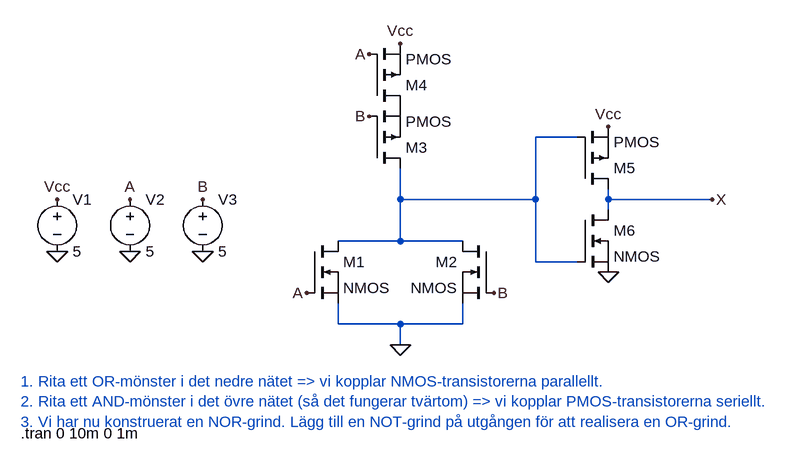
[diagram p0: schematic or.asc]
or.asc, the LTspice schematic file:
Version 4.1
SHEET 1 1244 680
WIRE 816 32 752 32
WIRE 544 128 544 80
WIRE 752 128 752 32
WIRE 752 128 544 128
WIRE 864 128 864 112
WIRE 1024 128 864 128
WIRE 864 144 864 128
WIRE 544 192 544 128
WIRE 544 192 448 192
WIRE 640 192 544 192
WIRE 752 224 752 128
WIRE 816 224 752 224
WIRE 448 320 448 288
WIRE 544 320 448 320
WIRE 640 320 640 288
WIRE 640 320 544 320
WIRE 544 352 544 320
FLAG 16 208 0
FLAG 128 208 0
FLAG 240 208 0
FLAG 16 128 Vcc
FLAG 128 128 A
FLAG 240 128 B
FLAG 544 352 0
FLAG 400 272 A
FLAG 688 272 B
FLAG 544 -112 Vcc
FLAG 496 -96 A
FLAG 496 0 B
FLAG 864 240 0
FLAG 864 16 Vcc
FLAG 1024 128 X
SYMBOL voltage 16 112 R0
WINDOW 123 0 0 Left 0
WINDOW 39 0 0 Left 0
SYMATTR InstName V1
SYMATTR Value 5
SYMBOL voltage 128 112 R0
WINDOW 123 0 0 Left 0
WINDOW 39 0 0 Left 0
SYMATTR InstName V2
SYMATTR Value 5
SYMBOL voltage 240 112 R0
WINDOW 123 0 0 Left 0
WINDOW 39 0 0 Left 0
SYMATTR InstName V3
SYMATTR Value 5
SYMBOL nmos 400 192 R0
SYMATTR InstName M1
SYMBOL nmos 688 192 M0
SYMATTR InstName M2
SYMBOL pmos 496 80 M180
SYMATTR InstName M3
SYMBOL pmos 496 -16 M180
SYMATTR InstName M4
SYMBOL pmos 816 112 M180
SYMATTR InstName M5
SYMBOL nmos 816 144 R0
SYMATTR InstName M6
TEXT -40 408 Left 2 ;1. Rita ett OR-mönster i det nedre nätet => vi kopplar NMOS-transistorerna parallellt.\n2. Rita ett AND-mönster i det övre nätet (så det fungerar tvärtom) => vi kopplar PMOS-transistorerna seriellt.\n3. Vi har nu konstruerat en NOR-grind. Lägg till en NOT-grind på utgången för att realisera en OR-grind.
TEXT -40 488 Left 2 !.tran 0 10m 0 1m

The netlist it stands for:
* or.asc
V1 Vcc 0 5
V2 A 0 5
V3 B 0 5
M1 N001 A 0 0 NMOS
M2 N001 B 0 0 NMOS
M3 N001 B P001 P001 PMOS
M4 P001 A Vcc Vcc PMOS
M5 X N001 Vcc Vcc PMOS
M6 X N001 0 0 NMOS
.model NMOS NMOS
.model PMOS PMOS
.lib standard.mos
* 1. Rita ett OR-mönster i det nedre nätet => vi kopplar NMOS-transistorerna parallellt.
* 2. Rita ett AND-mönster i det övre nätet (så det fungerar tvärtom) => vi kopplar PMOS-transistorerna seriellt.
* 3. Vi har nu konstruerat en NOR-grind. Lägg till en NOT-grind på utgången för att realisera en OR-grind.
.tran 0 10m 0 1m
.backanno
.end